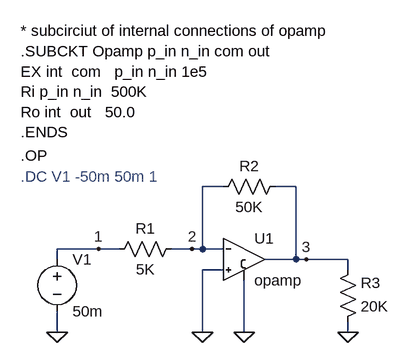
[diagram p0: schematic inverting_opamp1.asc]
inverting_opamp1.asc, the LTspice schematic file:
Version 4
SHEET 1 880 680
WIRE -240 240 -240 224
WIRE -240 352 -240 320
WIRE -176 224 -240 224
WIRE -144 224 -176 224
WIRE -32 224 -64 224
WIRE -16 224 -32 224
WIRE -16 224 -16 128
WIRE -16 352 -16 256
WIRE 16 128 -16 128
WIRE 16 224 -16 224
WIRE 16 256 -16 256
WIRE 48 352 48 272
WIRE 128 128 96 128
WIRE 128 240 80 240
WIRE 128 240 128 128
WIRE 144 240 128 240
WIRE 208 240 144 240
WIRE 208 256 208 240
WIRE 208 352 208 336
FLAG -240 352 0
FLAG -16 352 0
FLAG 208 352 0
FLAG 48 352 0
FLAG -176 224 1
FLAG -32 224 2
FLAG 144 240 3
SYMBOL res -48 208 R90
WINDOW 0 0 56 VBottom 0
WINDOW 3 32 56 VTop 0
SYMATTR InstName R1
SYMATTR Value 5K
SYMBOL res 112 112 R90
WINDOW 0 0 56 VBottom 0
WINDOW 3 32 56 VTop 0
SYMATTR InstName R2
SYMATTR Value 50K
SYMBOL res 192 352 M180
WINDOW 0 36 76 Left 0
WINDOW 3 36 40 Left 0
SYMATTR InstName R3
SYMATTR Value 20K
SYMBOL voltage -240 224 R0
WINDOW 123 0 0 Left 0
WINDOW 39 0 0 Left 0
SYMATTR InstName V1
SYMATTR Value 50m
SYMBOL opamp_4pin 32 240 R0
SYMATTR InstName U1
SYMATTR Value opamp
TEXT -296 112 Left 0 ;.DC V1 -50m 50m 1
TEXT -296 -112 Left 0 !* subcirciut of internal connections of opamp\n.SUBCKT Opamp p_in n_in com out\nEX int  com   p_in n_in 1e5\nRi p_in n_in  500K\nRo int  out   50.0\n.ENDS
TEXT -296 80 Left 0 !.OP

The netlist it stands for:
* inverting_opamp1.asc
R1 2 1 5K
R2 3 2 50K
R3 0 3 20K
V1 1 0 50m
XU1 0 2 0 3 opamp  ; pins In+ In- COM OUT
* .DC V1 -50m 50m 1
* subcirciut of internal connections of opamp
.SUBCKT Opamp p_in n_in com out
EX int  com   p_in n_in 1e5
Ri p_in n_in  500K
Ro int  out   50.0
.ENDS
.OP
.backanno
.end